# Altium schematic sheet Cyber_VCM.SchDoc
size A3
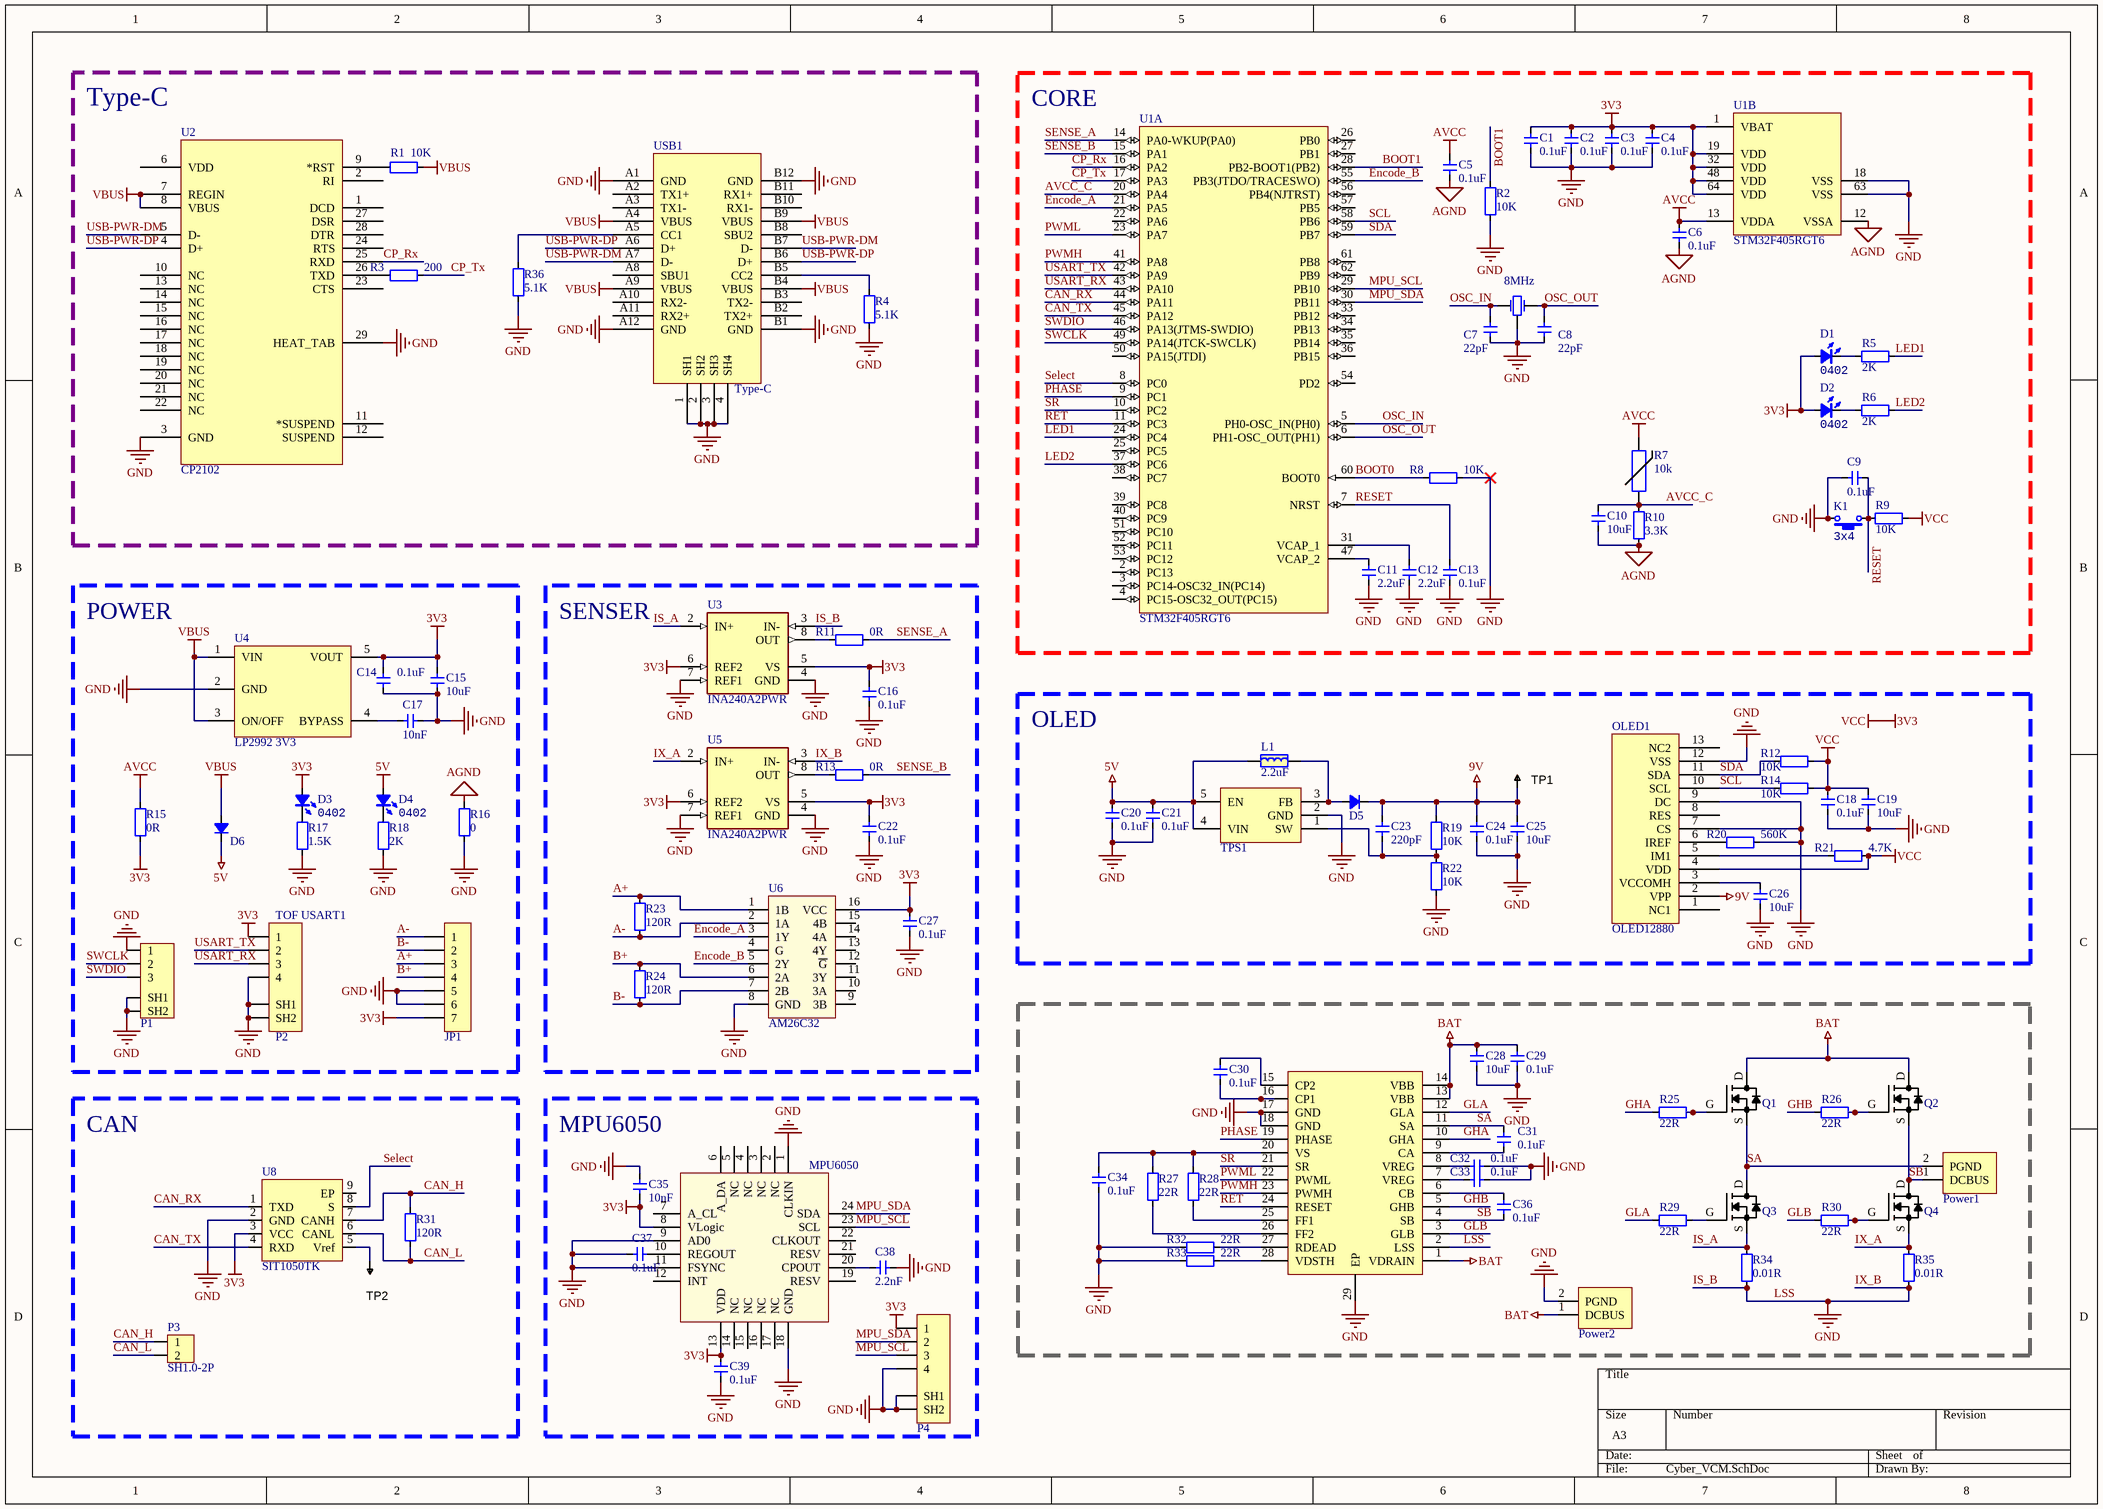
[diagram p0: Cyber_VCM.SchDoc]

## Parts
*1  A3941  [TSSOP28_n]  (value not drawn)
C1  0.1uF  [CAP_0402]
C2  0.1uF  [CAP_0402]
C3  0.1uF  [CAP_0402]
C4  0.1uF  [CAP_0402]
C5  0.1uF  [0603-CAP]
C6  0.1uF  [0603-CAP]
C7  22pF  [CAP_0402]
C8  22pF  [CAP_0402]
C9  0.1uF  [CAP_0402]
C10  10uF  [CAP_0402]
C11  2.2uF  [CAP_0402]
C12  2.2uF  [CAP_0402]
C13  0.1uF  [CAP_0402]
C14  0.1uF  [CAP_0402]
C15  10uF  [CAP_0402]
C16  0.1uF  [CAP_0402]
C17  10nF  [CAP_0402]
C18  0.1uF  [CAP_0402]
C19  10uF  [CAP_0402]
C20  0.1uF  [CAP_0402]
C21  0.1uF  [CAP_0402]
C22  0.1uF  [CAP_0402]
C23  220pF  [CAP_0402]
C24  0.1uF  [0603-CAP]
C25  10uF  [0603-CAP]
C26  10uF  [CAP_0402]
C27  0.1uF  [0603-CAP]
C28  10uF  [2520-L]
C29  0.1uF  [2520-L]
C30  0.1uF  [0603-CAP]
C31  0.1uF  [CAP_0402]
C32  0.1uF  [CAP_0402]
C33  0.1uF  [CAP_0402]
C34  0.1uF  [0603-CAP]
C35  10nF  [CAP_0402]
C36  0.1uF  [CAP_0402]
C37  0.1uF  [CAP_0402]
C38  2.2nF  [CAP_0402]
C39  0.1uF  [CAP_0402]
D1  Type: 0402  [LED_0402_BLUE]  (hidden comment: color?)
D2  Type: 0402  [LED_0402_BLUE]  (hidden comment: color?)
D3  Type: 0402  [LED_0402_BLUE]  (hidden comment: color?)
D4  Type: 0402  [LED_0402_BLUE]  (hidden comment: color?)
D5  二极管-5819W  [SOD-123]  (value not drawn)
D6  二极管-5819W  [SOD-123]  (value not drawn)
JP1  SH1.0-7P  [SH1.0-7P-L]  (value not drawn)
K1  value 3x4  [ButtonTACT_3x4x2_180]  (hidden comment: TACT 2P)
L1  2.2uF  [2520-L]
OLED1  OLED12880  [OLED12880]
P1  SH1.0-3P  [SH1.0-3P]  (value not drawn)
P2  TOF USART1  [SH1.0-4P]
P3  SH1.0-2P  [SH1.0-2P]
P4  SH1.0-4P  [SH1.0-4P]  (value not drawn)
Power1  电源  [音圈电机电源接口]  (value not drawn)
Power2  电源  [TX60电源]  (value not drawn)
Q1  NTMFS4935NT1G  [SO8FL]  (value not drawn)
Q2  NTMFS4935NT1G  [SO8FL]  (value not drawn)
Q3  NTMFS4935NT1G  [SO8FL]  (value not drawn)
Q4  NTMFS4935NT1G  [SO8FL]  (value not drawn)
R1  10K  [RES_0402]
R2  10K  [RES_0402]
R3  200  [RES_0402]
R4  5.1K  [RES_0402]
R5  2K  [RES_0402]
R6  2K  [RES_0402]
R7  value 10k  [RES_0402]  (hidden comment: NCP15XH103F03RC)
R8  10K  [RES_0402]
R9  10K  [RES_0402]
R10  3.3K  [RES_0402]
R11  0R  [RES_0402]
R12  10K  [RES_0402]
R13  0R  [RES_0402]
R14  10K  [RES_0402]
R15  0R  [RES_0402]
R16  0  [RES_0402]
R17  1.5K  [RES_0402]
R18  2K  [RES_0402]
R19  10K  [RES_0402]
R20  560K  [RES_0402]
R21  4.7K  [RES_0402]
R22  10K  [RES_0402]
R23  120R  [RES_0603]
R24  120R  [RES_0603]
R25  22R  [RES_0402]
R26  22R  [RES_0402]
R27  22R  [RES_0402]
R28  22R  [RES_0402]
R29  22R  [RES_0402]
R30  22R  [RES_0402]
R31  120R  [RES_0402]
R32  22R  [RES_0402]
R33  22R  [RES_0402]
R34  0.01R  [1206-RES]
R35  0.01R  [1206-RES]
R36  5.1K  [RES_0402]
TP1  TESTPOINT  [TP-R30]  (value not drawn)  (no BOM)
TP2  TESTPOINT  [TP-R30]  (value not drawn)  (no BOM)
TPS1  TPS61040DBV  [SOT23-5]  (value not drawn)
U1  STM32F405RGT6  [主控芯片LQFP64-10*10]  (parts A,B of 2)
U2  CP2102  [QFN-28]
U3  INA240A2PWR  [SOP65 P640X120-8N]
U4  LP2992 3V3  [SOT23-5]
U5  INA240A2PWR  [SOP65 P640X120-8N]
U6  AM26C32  [SOP16]
U7  MPU6050  [QFN-24]
U8  SIT1050TK  [DFN3x3-8]
USB1  Type-C  [Type-C-TOP]
X1  8MHz  [晶振-3P]

## Blocks framed on the sheet
Type-C: R1 R3 R4 R36 U2 USB1
CORE: C1-C13 D1 D2 K1 R2 R5-R10 U1 X1
POWER: C14 C15 C17 D3 D4 D6 JP1 P1 P2 R15-R18 U4
SENSER: C16 C22 C27 R11 R13 R23 R24 U3 U5 U6
OLED: C18-C21 C23-C26 D5 L1 OLED1 R12 R14 R19-R22 TP1 TPS1
CAN: P3 R31 TP2 U8
MPU6050: C35 C37-C39 P4 U7

## Nets
3V3: C1.2 C2.2 C3.2 C4.2 C14.2 C15.2 C16.2 C18.2 C19.2 C22.2 C27.2 C35.1 C39.2 D1.1(A) D2.1(A) D3.1(A) JP1.7 OLED1.4(VDD) P2.1 P4.1 R9.1 R12.2 R14.2 R15.2 R21.2 U1.1(VBAT) U1.19(VDD) U1.32(VDD) U1.48(VDD) U1.64(VDD) U3.5(VS) U3.6(REF2) U4.5(VOUT) U5.5(VS) U5.6(REF2) U6.16(VCC) U7.8(VLogic) U7.13(VDD) U8.3(VCC)  [also labelled VCC]
5V: C20.2 C21.2 D4.1(A) D6.2(K) L1.1 TPS1.4(VIN) TPS1.5(EN)
9V: C23.2 C24.2 C25.2 D5.2(K) OLED1.2(VPP) R19.2 TP1.1
AGND: C5.1 C6.1 C10.1 R10.1 R16.1 U1.12(VSSA)
AVCC: C5.2 C6.2 R7.2 R15.1 U1.13(VDDA)
BAT: *1.1(VDRAIN) *1.13(VBB) *1.14(VBB) C28.2 C29.2 Power2.1(DCBUS) Q1.D Q2.D
IS_B: *1.2(LSS) *1.17(GND) *1.18(GND) *1.29(EP) C1.1 C2.1 C3.1 C4.1 C7.1 C8.1 C9.1 C11.1 C12.1 C13.2 C14.1 C15.1 C16.1 C17.2 C18.1 C19.1 C20.1 C21.1 C22.1 C24.1 C25.1 C26.1 C27.1 C28.1 C29.1 C32.1 C33.1 C34.1 C35.2 C37.2 C38.1 C39.1 JP1.5 JP1.6 K1.2 OLED1.7(CS) OLED1.9(DC) OLED1.12(VSS) P1.1 P1.SH1 P1.SH2 P2.4 P2.SH1 P2.SH2 P4.4 P4.SH1 P4.SH2 Power2.2(PGND) R2.1 R4.2 R8.1 R16.2 R17.2 R18.2 R20.2 R22.1 R32.1 R33.1 R34.1 R35.1 R36.2 TPS1.2(GND) U1.18(VSS) U1.63(VSS) U2.3(GND) U2.29(HEAT_TAB) U3.3(IN-) U3.4(GND) U3.7(REF1) U4.2(GND) U5.3(IN-) U5.4(GND) U5.7(REF1) U6.8(GND) U7.1(CLKIN) U7.9(AD0) U7.11(FSYNC) U7.18(GND) U8.2(GND) USB1.1(SH1) USB1.2(SH2) USB1.3(SH3) USB1.4(SH4) USB1.A1(GND) USB1.A12(GND) USB1.B1(GND) USB1.B12(GND) X1.2(GND)  [also labelled GND, IX_B, LSS]
VBUS: D6.1(A) R1.1 U2.7(REGIN) U2.8(VBUS) U4.1(VIN) U4.3(ON/OFF) USB1.A4(VBUS) USB1.A9(VBUS) USB1.B4(VBUS) USB1.B9(VBUS)
A+: JP1.3 R23.2 U6.1(1B)
A-: JP1.1 R23.1 U6.2(1A)
AVCC_C: C10.2 R7.1 R10.2 U1.20(PA4)
B+: JP1.4 R24.2 U6.6(2A)
B-: JP1.2 R24.1 U6.7(2B)
BOOT0: R8.2 U1.60(BOOT0)
BOOT1: R2.2 U1.28(PB2-BOOT1(PB2))
CAN_H: P3.1 R31.2 U8.7(CANH)
CAN_L: P3.2 R31.1 U8.6(CANL)
CAN_RX: U1.44(PA11) U8.1(TXD)
CAN_TX: U1.45(PA12) U8.4(RXD)
CP_Rx: U1.16(PA2) U2.25(RXD)
CP_Tx: R3.1 U1.17(PA3)
Encode_A: U1.21(PA5) U6.3(1Y)
Encode_B: U1.55(PB3(JTDO/TRACESWO)) U6.5(2Y)
GHA: *1.10(GHA) R25.1
GHB: *1.5(GHB) R26.1
GLA: *1.12(GLA) R29.1
GLB: *1.3(GLB) R30.1
IS_A: Q3.S R34.2 U3.2(IN+)
IX_A: Q4.S R35.2 U5.2(IN+)
LED1: R5.2 U1.24(PC4)
LED2: R6.2 U1.37(PC6)
MPU_SCL: P4.3 U1.29(PB10) U7.23(SCL)
MPU_SDA: P4.2 U1.30(PB11) U7.24(SDA)
OSC_IN: C7.2 U1.5(PH0-OSC_IN(PH0)) X1.1(OSC1)
OSC_OUT: C8.2 U1.6(PH1-OSC_OUT(PH1)) X1.3(OSC2)
PHASE: *1.19(PHASE) U1.9(PC1)
PWMH: *1.23(PWMH) U1.41(PA8)
PWML: *1.22(PWML) U1.23(PA7)
RESET: C9.2 C13.1 K1.1 R9.2 U1.7(NRST)
RET: *1.24(RESET) U1.11(PC3)
SA: *1.11(SA) C31.2 Power1.2(PGND) Q1.S Q3.D
SB: *1.4(SB) C36.1 Power1.1(DCBUS) Q2.S Q4.D
SCL: OLED1.10(SCL) R14.1 U1.58(PB6)
SDA: OLED1.11(SDA) R12.1 U1.59(PB7)
Select: U1.8(PC0) U8.8(S)
SENSE_A: R11.2 U1.14(PA0-WKUP(PA0))
SENSE_B: R13.2 U1.15(PA1)
SR: *1.21(SR) U1.10(PC2)
SWCLK: P1.2 U1.49(PA14(JTCK-SWCLK))
SWDIO: P1.3 U1.46(PA13(JTMS-SWDIO))
USART_RX: P2.3 U1.43(PA10)
USART_TX: P2.2 U1.42(PA9)
USB-PWR-DM: U2.5(D-) USB1.A7(D-) USB1.B7(D-)
USB-PWR-DP: U2.4(D+) USB1.A6(D+) USB1.B6(D+)
Net*1_6: *1.6(CB) C36.2
Net*1_7: *1.7(VREG) C33.2
Net*1_8: *1.8(VREG) C32.2
Net*1_9: *1.9(CA) C31.1
Net*1_15: *1.15(CP2) C30.2
Net*1_16: *1.16(CP1) C30.1
Net*1_20: *1.20(VS) C34.2 R27.2 R28.2
Net*1_25: *1.25(FF1) R28.1
Net*1_26: *1.26(FF2) R27.1
Net*1_27: *1.27(RDEAD) R32.2
Net*1_28: *1.28(VDSTH) R33.2
NetC11_2: C11.2 U1.47(VCAP_2)
NetC12_2: C12.2 U1.31(VCAP_1)
NetC17_1: C17.1 U4.4(BYPASS)
NetC23_1: C23.1 R19.1 R22.2 TPS1.1(SW)
NetC26_2: C26.2 OLED1.3(VCCOMH)
NetC37_1: C37.1 U7.10(REGOUT)
NetC38_2: C38.2 U7.20(CPOUT)
NetD1_2: D1.2(K) R5.1
NetD2_2: D2.2(K) R6.1
NetD3_2: D3.2(K) R17.1
NetD4_2: D4.2(K) R18.1
NetD5_1: D5.1(A) L1.2 TPS1.3(FB)
NetOLED1_5: OLED1.5(IM1) R21.1
NetOLED1_6: OLED1.6(IREF) R20.1
NetQ1_G: Q1.G R25.2
NetQ2_G: Q2.G R26.2
NetQ3_G: Q3.G R29.2
NetQ4_G: Q4.G R30.2
NetR1_2: R1.2 U2.9(*RST)
NetR3_2: R3.2 U2.26(TXD)
NetR4_1: R4.1 USB1.B5(CC2)
NetR11_1: R11.1 U3.8(OUT)
NetR13_1: R13.1 U5.8(OUT)
NetR36_1: R36.1 USB1.A5(CC1)
NetTP2_1: TP2.1 U8.5(Vref)

Not connected (* = marked no-connect by the designer): OLED1 1(NC1) 8(RES) 13(NC2); U1 2(PC13) 3(PC14-OSC32_IN(PC14)) 4(PC15-OSC32_OUT(PC15)) 22(PA6) 25(PC5) 26(PB0) 27(PB1) 33(PB12) 34(PB13) 35(PB14) 36(PB15) 38(PC7) 39(PC8) 40(PC9) 50(PA15(JTDI)) 51(PC10) 52(PC11) 53(PC12) 54(PD2) 56(PB4(NJTRST)) 57(PB5) 61(PB8) 62(PB9); U2 1(DCD) 2(RI) 6(VDD) 10(NC) 11(*SUSPEND) 12(SUSPEND) 13(NC) 14(NC) 15(NC) 16(NC) 17(NC) 18(NC) 19(NC) 20(NC) 21(NC) 22(NC) 23(CTS) 24(RTS) 27(DSR) 28(DTR); U6 4(G) 9(3B) 10(3A) 11(3Y) 12(~{G}) 13(4Y) 14(4A) 15(4B); U7 2(NC) 3(NC) 4(NC) 5(NC) 6(A_DA) 7(A_CL) 12(INT) 14(NC) 15(NC) 16(NC) 17(NC) 19(RESV) 21(RESV) 22(CLKOUT); U8 9(EP); USB1 A2(TX1+) A3(TX1-) A8(SBU1) A10(RX2-) A11(RX2+) B2(TX2+) B3(TX2-) B8(SBU2) B10(RX1-) B11(RX1+)

## Library data of the parts
C1-C4 C7-C23 C26 C31-C33 C35-C39 = 电容-0402: Capacitor; Value: 0.1u
C5 C6 C24 C25 C27 C30 C34 = 电容-0603: Capacitor; Value: 0.1u
C28 C29 = 电容-1206: Capacitor; Value: 0.1u
D1-D4 = LED_0402: LED; Value: color?
D5 D6 = 二极管-5819W: 40V
JP1 = SH1.0-7P: BOM名称: 7P接插件; 厂商: JST
K1 = ButtonTACT_3x4x2_180: Button; type: TACT 2P
L1 = 电感-0805: 磁珠
OLED1 = OLED12880: 12880寸OLED
P1 = SH1.0-3P: Header
P2 P4 = SH1.0-4P: BOM名称: 4P接插件; 厂商: JST
Power1 Power2 = 电源: 12~24VDC电源
Q1-Q4 = NTMFS4935NT1G: MOSFET N-CH 30V 13A SO8FL; Manufacturer: ON Semiconductor; FET Type: N-Channel; Current - Continuous Drain (Id) @ 25°C: 13A (Ta), 93A (Tc); Drive Voltage (Max Rds On,  Min Rds On): 4.5V, 10V; Vgs(th) (Max) @ Id: 2.2V @ 250µA; Gate Charge (Qg) (Max) @ Vgs: 49.4nC @ 10V; Input Capacitance (Ciss) (Max) @ Vds: 4850pF @ 15V; Vgs (Max): ±20V; Power Dissipation (Max): 930mW (Ta), 48W (Tc); Rds On (Max) @ Id, Vgs: 3.2 mOhm @ 30A, 10V; Supplier 1: Digi-Key; Supplier Part Number 1: NTMFS4935NT1GOSCT-ND; RoHS: RoHS Compliant; Category: Discrete Semiconductor Products; Stock 1: 932; Pricing 1: 1=0.61, 10=0.541, 100=0.4145, 500=0.3277 (USD); Packaging: Cut Tape (CT); Part Status: Active; Technology: MOSFET (Metal Oxide); Drain to Source Voltage (Vdss): 30V; FET Feature: -; Operating Temperature: -55°C ~ 150°C (TJ); Mounting Type: Surface Mount; Supplier Device Package: 5-DFN (5x6) (8-SOFL); Package / Case: 8-PowerTDFN, 5 Leads; ComponentLink1URL: http://www.onsemi.com/pub_link/Collateral/NTMFS4935N-D.PDF; ComponentLink1Description: http://www.onsemi.com/pub_link/Collateral/NTMFS4935N-D.PDF; Manufacturer Part Number: NTMFS4935NT1G
R1-R6 R8-R22 R31 R36 = 电阻-0402: Resistor; Value: 22R
R7 = NCP15XH103F03RC: THERMISTOR 10K OHM NTC 0402 SMD
R23 R24 = 电阻-0603: Resistor; Value: 22R
R25-R30 R32 R33 = 电阻-0402: Resistor; Value: 22R
R34 R35 = 电阻-1206: Resistor; Value: 22R
TP1 TP2 = TESTPOINT: SMD test pin
U1 = STM32F405RGT6: ARM Cortex-M4 32-bit MCU+FPU, 210 DMIPS, 1024 kB Flash, 192 kB Internal RAM, 51 I/Os, 64-pin LQFP, -40 to 85 degC, Tray; Manufacturer: STMicroelectronics; D/A Converter: 2x12-bit; FLASH Size (Prog) (kB): 1024; I/Os (High Current): 51; Internal RAM Size (kB): 192; Operating Frequency(F) (Processor speed) (MHz): 168; Supply Voltage(Vcc) max (V): 3.6; Supply Voltage(Vcc) min (V): 1.8; DatasheetVersion: Rev. 4; PackageVersion: Rev. 4, 06/2013; PackageReference: LQFP64; PackageDescription: 64-Pin Low Profile Quad Flat Package, 10 x 10 mm Body, 0.5 mm Pitch; Supplier 1: Digi-Key; Supplier Part Number 1: 497-11767-ND; Supplier 2: Farnell; Supplier Part Number 2: 2064363; Supplier 3: Newark; Supplier Part Number 3: 73T2329; Supplier 4: Mouser; Supplier Part Number 4: 511-STM32F405RGT6; Core: ARM Cortex-M4; Packing: Tray; Mounting Technology: Surface Mount; ComponentLink1Description: Manufacturer URL; ComponentLink1URL: http://www.st.com/web/en/home.html; ComponentLink2Description: Datasheet; ComponentLink2URL: http://www.st.com/st-web-ui/static/active/en/resource/technical/document/datasheet/DM00037051.pdf; ComponentLink3Description: Package Specification; ComponentLink3URL: http://www.st.com/st-web-ui/static/active/en/resource/technical/document/datasheet/DM00037051.pdf
U2 = CP2102: USB转TTL; PART DESC: SINGLE-CHIP USB TO UART BRIDGE, QFN28, RoHS.; MFG #1: SILICON LABS; PART NUMBER: CP2102; Value: Value; RefDes: RefDes; Type: DEV
U3 U5 = INA240A2PWR: -4 to 80V, bidirectional, ultra-precise current sense amplifier with enhanced PWM rejection 8-TSSOP -40 to 125; MF: Texas Instruments; MP: INA240A2PWR; Value: *; Package: TSSOP-8 Texas Instruments; Price: None; Availability: Good; Purchase-URL: https://pricing.snapeda.com/search/part/INA240A2PWR/?ref=eda; SnapEDA_Link: https://www.snapeda.com/parts/INA240A2PWR/Texas%20Instruments/view-part/588604/?ref=snap
U4 = LP2992: LDO
U6 = AM26C32: AM26C32 Quadruple Differential Line Receiver
U7 = MPU6050: 六轴传感器
U8 = SIT1050TK: CAN收发器，DFN3x3-8
USB1 = USB-Type-C-TOP
X1 = XTAL-3215